# EAGLE design CxT6 (EAGLE 4.13)
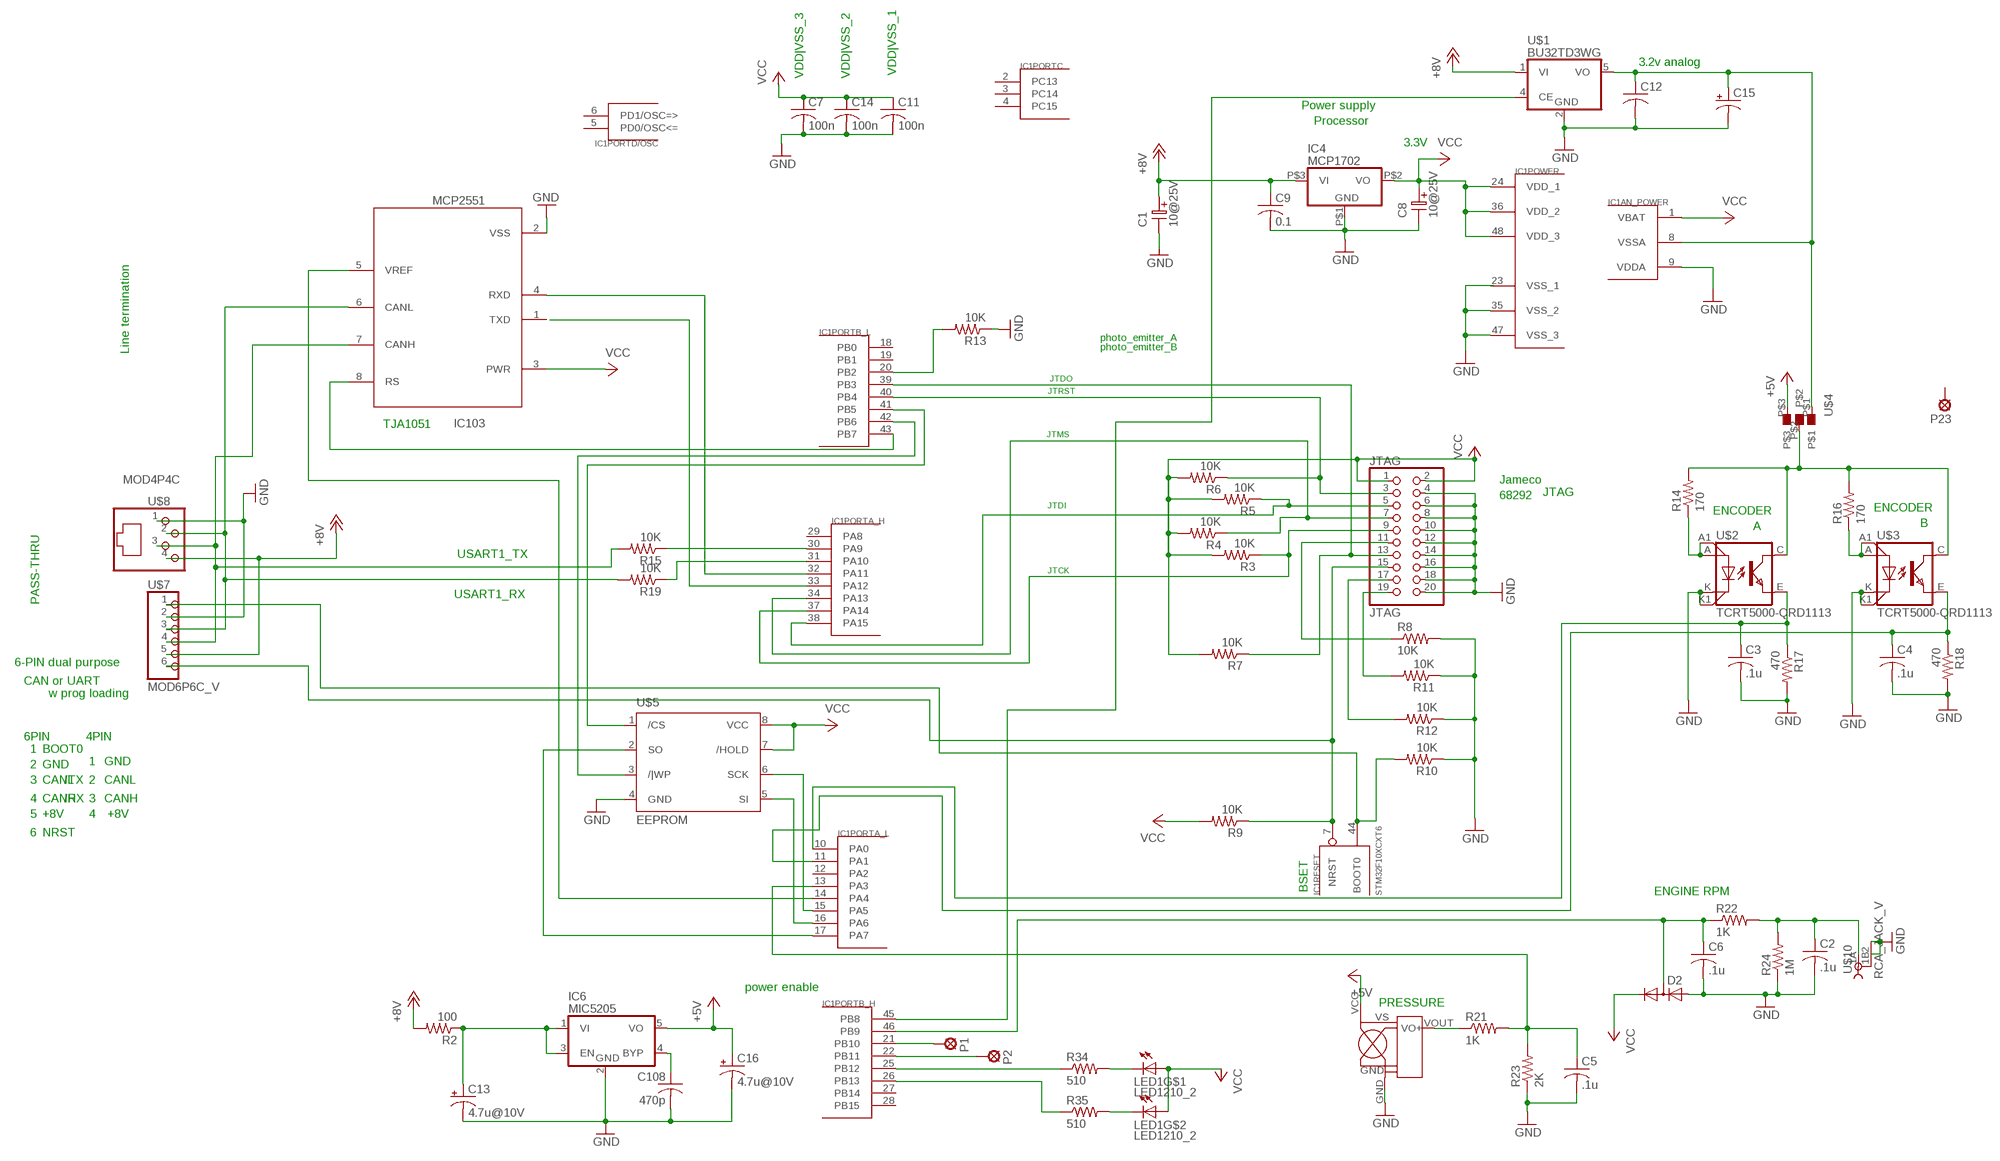
[diagram p0: schematic, sheet 1]

## Parts
C1  10@25V  ELC-2,5L  [ES-2,5L]
C2  .1u  C-USC0805  [C0805]
C3  .1u  C-USC0805  [C0805]
C4  .1u  C-USC0805  [C0805]
C5  .1u  C-USC0805  [C0805]
C6  .1u  C-USC0805  [C0805]
C7  100n  C-USC0603  [C0603]
C8  10@25V  ELC-2,5L  [ES-2,5L]
C9  0.1  C-USC0603  [C0603]
C11  100n  C-USC0603  [C0603]
C12  C-USC0603  [C0603]
C13  4.7u@10V  CPOL-USCT3528  [CT3528]
C14  100n  C-USC0603  [C0603]
C15  CPOL-USE5-8.5  [E5-8,5]
C16  4.7u@10V  CPOL-USCT3528  [CT3528]
C108  470p  C-USC0603  [C0603]
D2  DIODE_2CACA-SOT23  [SOT23]
IC1  STM32F10XCXT6  [TQFP48]
IC4  MCP1702  [SOT-23A]
IC6  MIC5205  [SOT-25]
IC103  MCP2551  [SO-08]
JTAG  JTAG  PINHD-2X10_KEYED  [2X10_KEYED]
LED1  LED1210_2  [CHIP2LED_1210]
P1  PE14  SOLDPAD028  [SOLPAD028]
P2  PE14  SOLDPAD028  [SOLPAD028]
P23  PE14  SOLDPAD028  [SOLPAD028]
R2  100  R-US_R0603  [R0603]
R3  10K  R-US_R0603  [R0603]
R4  10K  R-US_R0603  [R0603]
R5  10K  R-US_R0603  [R0603]
R6  10K  R-US_R0603  [R0603]
R7  10K  R-US_R0603  [R0603]
R8  10K  R-US_R0603  [R0603]
R9  10K  R-US_R0603  [R0603]
R10  10K  R-US_R0603  [R0603]
R11  10K  R-US_R0603  [R0603]
R12  10K  R-US_R0603  [R0603]
R13  10K  R-US_R0603  [R0603]
R14  170  R-US_M0805  [M0805]
R15  10K  R-US_R0603  [R0603]
R16  170  R-US_M0805  [M0805]
R17  470  R-US_R0603  [R0603]
R18  470  R-US_R0603  [R0603]
R19  10K  R-US_R0603  [R0603]
R21  1K  R-US_R0603  [R0603]
R22  1K  R-US_R0603  [R0603]
R23  2K  R-US_R0603  [R0603]
R24  1M  R-US_R0603  [R0603]
R34  510  R-US_R0603  [R0603]
R35  510  R-US_R0603  [R0603]
U$1  BU32TD3WG  XC6701  [SOT-25]
U$2  TCRT5000-QRD1113  [TCRT-QRD1114]
U$3  TCRT5000-QRD1113  [TCRT-QRD1114]
U$4  SMD-3  [SMD_3]
U$5  EEPROM  [TSSOP8]
U$6  MPXV6115  [482A]
U$7  MOD6P6C_V  [MOD6P6C_VERT]
U$8  MOD4P4C  [MOD4P4C]
U$10  RCA_JACK_V  [RCA_JACK_V]

## Nets
+5V: C16.+ IC6.5(VO) U$4.P$3 U$6.VCC(VS)
+8V: C1.1 C9.1 IC4.P$3(VI) R2.2 U$1.1(VI) U$7.5 U$8.4
+8V_VIA_RESISTOR: C13.+ IC6.1(VI) IC6.3(EN) R2.1
BOOT0: IC1.44(RESET:BOOT0) R10.2 U$7.1
BOOT1: IC1.20(PORTB_L:PB2) R13.2
CANH: IC103.7(CANH) R15.2 U$7.4 U$8.3
CANL: IC103.6(CANL) R19.2 U$7.3 U$8.2
CANRXD: IC1.32(PORTA_H:PA11) IC103.4(RXD)
CANTXD: IC1.33(PORTA_H:PA12)
EEPROM_/CS: IC1.41(PORTB_L:PB5) U$5.1(/CS)
EEPROM_/WP: IC1.42(PORTB_L:PB6) U$5.3(/|WP)
EEPROM_SCK: IC1.15(PORTA_L:PA5) U$5.6(SCK)
EEPROM_SI: IC1.16(PORTA_L:PA6) U$5.5(SI)
EEPROM_SO: IC1.17(PORTA_L:PA7) U$5.2(SO)
ENCODER_A_ANODE: R14.1 U$2.A1(ANODE1) U$2.A(ANODE)
ENCODER_B_ANODE: R16.1 U$3.A1(ANODE1) U$3.A(ANODE)
GND: C1.2 C2.2 C3.2 C4.2 C5.2 C6.2 C7.2 C8.2 C9.2 C11.2 C12.2 C13.- C14.2 C15.- C16.- C108.2 D2.1(A) IC1.9(AN_POWER:VDDA) IC1.35(POWER:VSS_2) IC1.47(POWER:VSS_3) IC4.P$1(GND) IC6.2(GND) IC103.2(VSS) JTAG.4 JTAG.6 JTAG.8 JTAG.10 JTAG.12 JTAG.14 JTAG.16 JTAG.18 JTAG.20 R8.2 R10.1 R11.1 R12.1 R13.1 R17.2 R18.2 R23.1 R24.1 U$1.2(GND) U$2.K1(CATHODE1) U$2.K(CATHODE) U$3.K1(CATHODE1) U$3.K(CATHODE) U$5.4(GND) U$6.GND U$7.2 U$8.1 U$10.1B U$10.2
IC6_BYP: C108.1 IC6.4(BYP)
JTAG_R-TO-GND-11: JTAG.11 R8.1
JTAG_R-TO-GND-17: JTAG.17 R12.2
JTAG_R-TO-GND-19: JTAG.19 R11.2
JTCK: IC1.37(PORTA_H:PA14) JTAG.9 R3.1
JTDI: IC1.38(PORTA_H:PA15) JTAG.5 R5.1
JTDO: IC1.39(PORTB_L:PB3) JTAG.13 R7.1
JTIMS: IC1.34(PORTA_H:PA13) JTAG.7 R4.1
JTRST: IC1.40(PORTB_L:PB4) JTAG.3 R6.1
NRST: IC1.7(RESET:NRST) JTAG.15 R9.1 U$7.6
PA3_ADC123IN1_PRESSURE: C5.1 IC1.13(PORTA_L:PA3) R21.2 R23.2
PA9_USART1_TX: IC1.30(PORTA_H:PA9) R15.1
PA10_USART1_RX: IC1.31(PORTA_H:PA10) R19.1
PB4_CAN_VREF: IC1.14(PORTA_L:PA4) IC103.5(VREF)
PB7_CAN_RS: IC1.43(PORTB_L:PB7) IC103.8(RS)
PB8_3.2V_ENABLE: IC1.45(PORTB_H:PB8) U$1.4(CE)
PB11_ENG_PULSE: C6.1 D2.3(AC) IC1.46(PORTB_H:PB9) R22.1
PB12_LED: IC1.25(PORTB_H:PB12) R34.1
PB12_LED1: LED1.C R34.2
PB13_LED: IC1.26(PORTB_H:PB13) R35.1
PB13_LED2: LED1.C1(C) R35.2
PHOTO_EMITTER_A: C3.1 IC1.10(PORTA_L:PA0) R17.1 U$2.E(EMITTER)
PHOTO_EMITTER_B: C4.1 IC1.11(PORTA_L:PA1) R18.1 U$3.E(EMITTER)
PHOTOSENSOR_V+: R14.2 R16.2 U$2.C(COLLECTOR) U$3.C(COLLECTOR) U$4.P$2
PRESSURE_OUT: R21.1 U$6.VOUT
SPRK_PICKUP: C2.1 R22.2 R24.2 U$10.1A
USART3_RX|XBEE: IC1.22(PORTB_H:PB11) P2.MP
USART3_TX|XBEE: IC1.21(PORTB_H:PB10) P1.MP
V3.2_ANALOG: C12.1 C15.+ IC1.8(AN_POWER:VSSA) U$1.5(VO) U$4.P$1
VCC: C7.1 C8.1 C11.1 C14.1 D2.2(C) IC1.1(AN_POWER:VBAT) IC1.24(POWER:VDD_1) IC1.36(POWER:VDD_2) IC1.48(POWER:VDD_3) IC4.P$2(VO) IC103.3(PWR) JTAG.1 JTAG.2 LED1.A LED1.A1(A) R3.2 R4.2 R5.2 R6.2 R7.2 R9.2 U$5.7(/HOLD) U$5.8(VCC)
Unconnected: IC1.2(PORTC:PC13) IC1.3(PORTC:PC14) IC1.4(PORTC:PC15) IC1.5(PORTD/OSC:PD0/OSC<=) IC1.6(PORTD/OSC:PD1/OSC=>) IC1.12(PORTA_L:PA2) IC1.18(PORTB_L:PB0) IC1.19(PORTB_L:PB1) IC1.27(PORTB_H:PB14) IC1.28(PORTB_H:PB15) IC1.29(PORTA_H:PA8) IC103.1(TXD) P23.MP

## Notes on the sheet
- 3.2v analog
- VDD|VSS_3 | VDD|VSS_2 | VDD|VSS_1
- Power supply
- Processor
- 3.3V
- photo_emitter_A
- photo_emitter_B
- Line termination
- JTDO
- JTRST
- TJA1051
- JTMS
- Jameco
- 68292 | JTAG
- JTDI
- ENCODER | ENCODER
- A | B
- USART1_TX
- JTCK
- USART1_RX
- PASS-THRU
- 6-PIN dual purpose
- CAN or UART
- w prog loading
- 6PIN | 4PIN
- 1 | BOOT0
- 2 | GND | 1 | GND
- 3 | CANL | /TX | 2 | CANL
- 4 | CANH | /RX | 3 | CANH
- 5 | +8V | 4 | +8V
- 6 | NRST
- BSET | ENGINE RPM
- power enable
- PRESSURE

## Power pins joined to a net without a drawn wire
VSS_1: IC1.23(POWER:VSS_1)

## Library data of the parts
C1 C8 = DEH:ELC-2,5L
C2-C7 C9 C11 C12 C14 C108 = rcl:C-US: CAPACITOR, American symbol
C13 C15 C16 = rcl:CPOL-US: POLARIZED CAPACITOR, American symbol
D2 = diode-1:DIODE_2CACA-: 2 Diodes - Cathode-Anode|Cathode-Anode
IC1 = stm32:STM32F10XCXT6: ST STM32F101/103 48pin LQFP
IC4 = linear:MCP1702
IC6 = linear:MIC5205
IC103 = texas:MCP2551
JTAG = pinhead:PINHD-2X10_KEYED
LED1 = led:LED1210_2
P1 P2 P23 = solpad:SOLDPAD028
R2-R19 R21-R24 R34 R35 = rcl:R-US_: RESISTOR, American symbol
U$1 = linear:XC6701
U$2 U$3 = tcrt5000:TCRT5000-QRD1113
U$4 = solpad:SMD-3
U$5 = texas:EEPROM
U$6 = motorola-sensor-driver:MPXV6115
U$7 = DEH:MOD6P6C_V
U$8 = DEH:MOD4P4C
U$10 = DEH:RCA_JACK_V

## Board
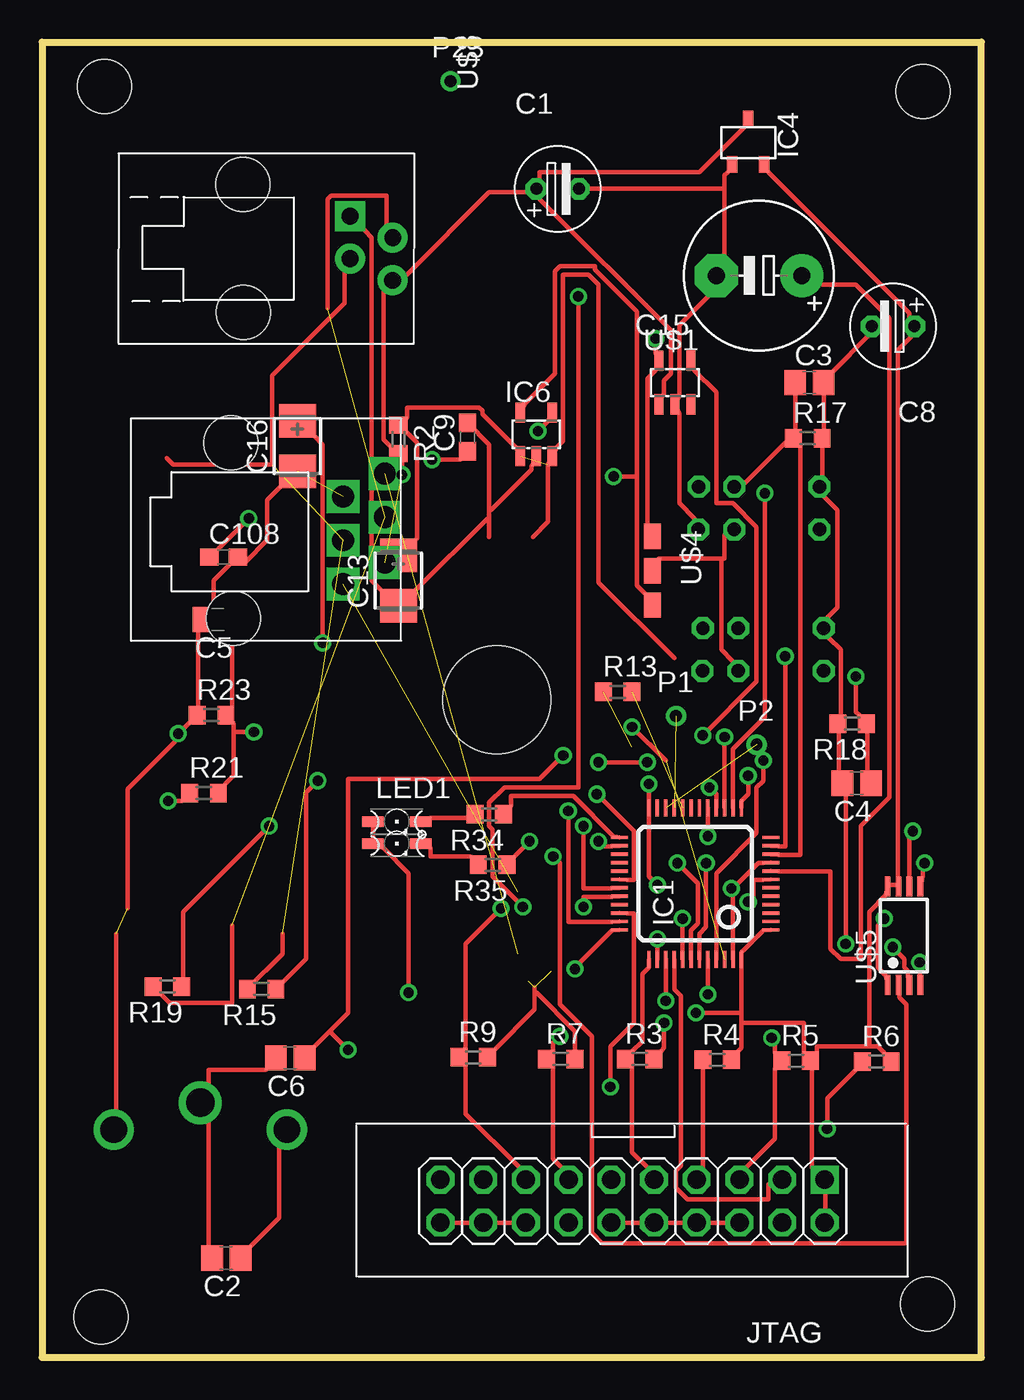
[diagram p1: board, top side]
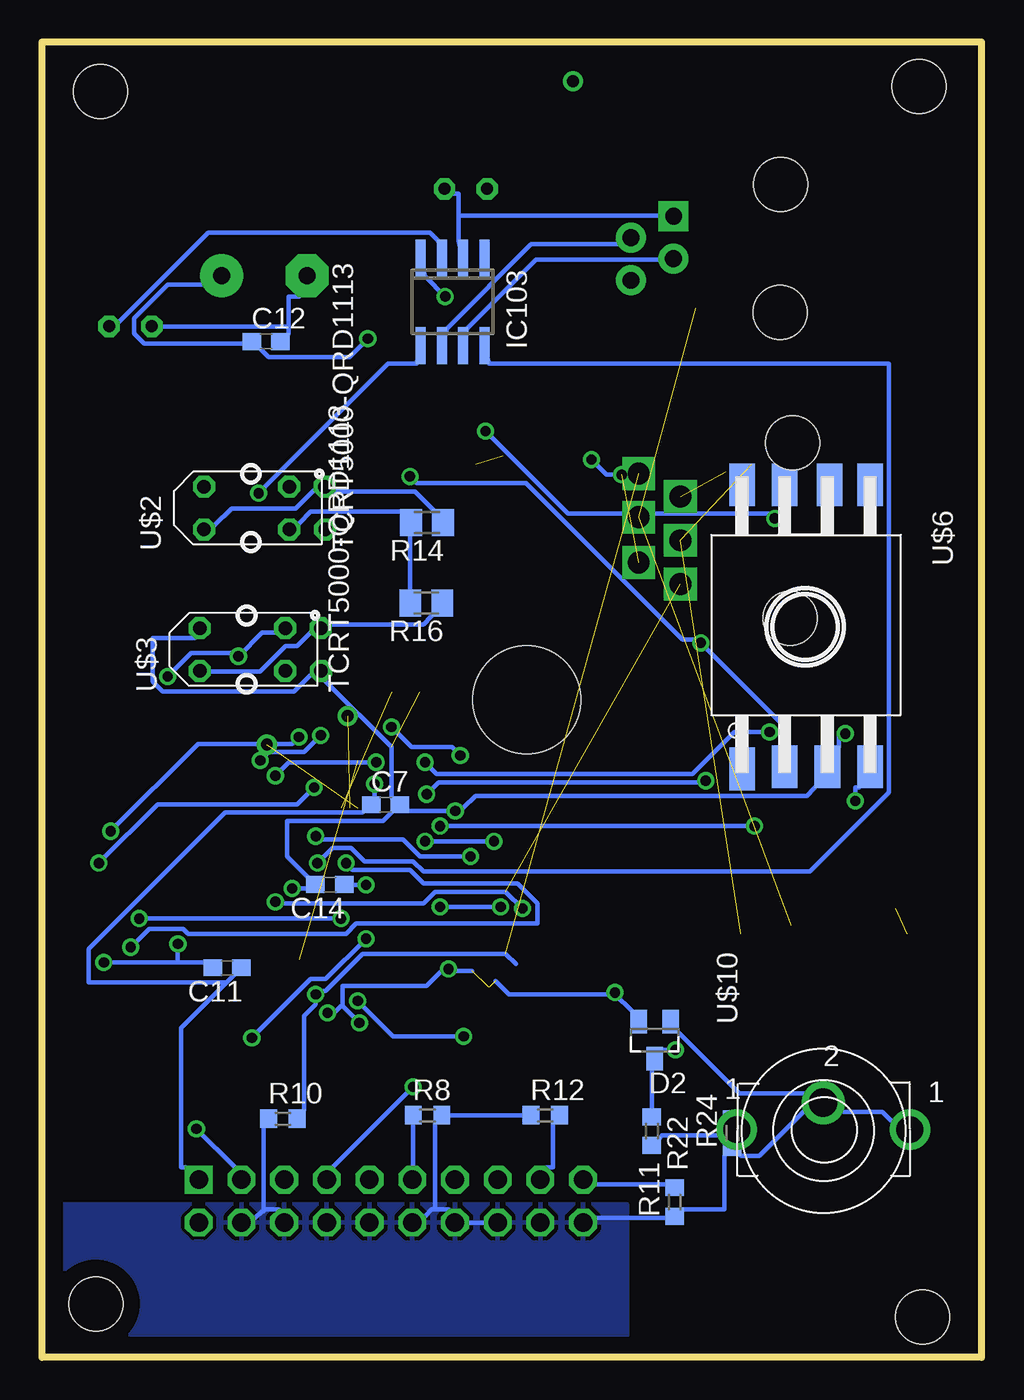
[diagram p2: board, bottom side, seen from below]

Size 55.88 x 78.23 mm. Coordinates in mm from the lower left corner, seen from the top.
Outline: 0,78.23 0,0 55.88,0 55.88,78.23 0,78.23
Copper layers (1*16): Top 0.035mm / dielectric 1.5mm / Bottom 0.035mm
Design rules "default": minimum track width 10mil, minimum drill 24mil, track to track 8mil, track to pad 8mil, pad to pad 8mil, via to via 8mil, smd to smd 8mil, copper to edge 40mil, drill to drill 8mil, minimum pad ring 10mil, minimum via ring 8mil, stop-mask expansion 4mil, vias tented up to drill 0mil, thermal gap 10mil
Holes 3.2 mm at 3.5,2.4 3.7,75.6 52.4,75.28 52.68,3.18
Holes 6.4 mm at 27.05,39.12

### Footprints (pad centres in the part's own frame; a part is rotated, then mirrored left to right if it is on the bottom)
ES-2,5L = drill 0.711 pad 1.27 octagon: 1 0,0; 2 2.54,0
C0805 = smd 1.3 x 1.5: 1 -0.85,0; 2 0.85,0
C0603 = smd 1.1 x 1: 1 -0.85,0; 2 0.85,0
CT3528 = smd 2 x 2.2: + 1.5,0; - -1.5,0
E5-8,5 = drill 1 pad 2.54 round: + -2.54,0 | drill 1 pad 2.54 octagon: - 2.54,0
SOT23 = smd 1 x 1.4: 1 -0.95,-1.1; 2 0.95,-1.1; 3 0,1.1
TQFP48 = smd 0.2 x 1: 1 -2.75,-4.5; 2 -2.25,-4.5; 3 -1.75,-4.5; 4 -1.25,-4.5; 5 -0.75,-4.5; 6 -0.25,-4.5; 7 0.25,-4.5; 8 0.75,-4.5; 9 1.25,-4.5; 10 1.75,-4.5; 11 2.25,-4.5; 12 2.75,-4.5; 25 2.75,4.5; 26 2.25,4.5; 27 1.75,4.5; 28 1.25,4.5; 29 0.75,4.5; 30 0.25,4.5; 31 -0.25,4.5; 32 -0.75,4.5; 33 -1.25,4.5; 34 -1.75,4.5; 35 -2.25,4.5; 36 -2.75,4.5 | smd 1 x 0.2: 13 4.5,-2.75; 14 4.5,-2.25; 15 4.5,-1.75; 16 4.5,-1.25; 17 4.5,-0.75; 18 4.5,-0.25; 19 4.5,0.25; 20 4.5,0.75; 21 4.5,1.25; 22 4.5,1.75; 23 4.5,2.25; 24 4.5,2.75; 37 -4.5,2.75; 38 -4.5,2.25; 39 -4.5,1.75; 40 -4.5,1.25; 41 -4.5,0.75; 42 -4.5,0.25; 43 -4.5,-0.25; 44 -4.5,-0.75; 45 -4.5,-1.25; 46 -4.5,-1.75; 47 -4.5,-2.25; 48 -4.5,-2.75
SOT-23A = smd 0.6 x 1: P$1 -0.95,-1.35; P$2 0.95,-1.35; P$3 0,1.35
SOT-25 = smd 0.55 x 1.2: 1 -0.95,-1.3; 2 0,-1.3; 3 0.95,-1.3; 4 0.95,1.3; 5 -0.95,1.3
SO-08 = smd 0.6 x 2.2: 1 -1.905,-2.6; 2 -0.635,-2.6; 3 0.635,-2.6; 4 1.905,-2.6; 5 1.905,2.6; 6 0.635,2.6; 7 -0.635,2.6; 8 -1.905,2.6
2X10_KEYED = drill 1.1 square: 1 -11.46,-1.27 | drill 1.1 octagon: 2 -11.46,1.27; 3 -8.92,-1.27; 4 -8.92,1.27; 5 -6.38,-1.27; 6 -6.38,1.27; 7 -3.84,-1.27; 8 -3.84,1.27; 9 -1.3,-1.27; 10 -1.3,1.27; 11 1.24,-1.27; 12 1.24,1.27; 13 3.78,-1.27; 14 3.78,1.27; 15 6.32,-1.27; 16 6.32,1.27; 17 8.86,-1.27; 18 8.86,1.27; 19 11.4,-1.27; 20 11.4,1.27
CHIP2LED_1210 = smd 1.27 x 0.635: A -1.422,0.67; A1 -1.422,-0.64; C 1.422,0.67; C1 1.422,-0.64
SOLPAD028 = drill 0.7 pad 1.016 round: MP 0,0
R0603 = smd 1 x 1.1: 1 -0.85,0; 2 0.85,0
M0805 = smd 1.3 x 1.6: 1 -0.95,0; 2 0.95,0
TCRT-QRD1114 = drill 0.8 octagon: A -2.54,-1.27; A1 4.648,1.27; C 2.54,-1.27; E 2.54,1.27; K -2.54,1.27; K1 4.674,-1.27
SMD_3 = smd 1.5 x 1: P$1 -2.04,-0.27; P$2 0,-0.27; P$3 2.04,-0.27
TSSOP8 = smd 1.2 x 0.35: 1 -2.925,0.975; 2 -2.925,0.325; 3 -2.925,-0.325; 4 -2.925,-0.975; 5 2.925,-0.975; 6 2.925,-0.325; 7 2.925,0.325; 8 2.925,0.975
482A = smd 2.54 x 1.524: GND 8.382,1.27; NC1 8.509,-3.81; NC2 -8.382,3.81; NC3 -8.382,1.397; NC4 -8.382,-1.27; NC5 -8.382,-3.81; VCC 8.382,-1.27; VOUT 8.382,3.81
MOD6P6C_VERT = drill 1.3 pad 1.778 square: 1 -2.694,0; 2 -1.324,-2.486; 3 -0.1,0; 4 1.27,-2.486; 5 2.594,0; 6 3.864,-2.486 | hole 3.2: -4.537,-9.154; 5.907,-9
MOD4P4C = drill 1 pad 1.778 square: 1 1.896,6.334 | drill 1 pad 1.778 round: 2 3.176,8.88; 3 4.43,6.344; 4 5.71,8.87 | hole 3.2: 7.627,0; 0.02,-0.02
RCA_JACK_V = drill 1.6 round: 1A -5.15,0; 1B 5.15,0 | drill 1.7 round: 2 0,1.6

### Placement (x,y rotation side)
C1  29.4,69.5 0 top
C2  10.96,5.91 180 top
C3  45.64,57.97 0 top
C4  48.46,34.15 180 top
C5  10.46,43.88 180 top
C6  14.76,17.81 180 top
C7  35.44,32.87 0 bottom
C8  51.89,61.33 180 top
C9  25.31,54.74 90 top
C11  44.86,23.18 180 bottom
C12  42.54,60.42 0 bottom
C13  21.2,46.2 90 top
C14  38.76,28.13 180 bottom
C15  42.65,64.34 180 top
C16  15.2,54.2 90 top
C108  10.8,47.6 0 top
D2  19.44,18.87 180 bottom
IC1  38.85,28.18 90 top
IC4  42,72.3 0 top
IC6  29.4,54.9 0 top
IC103  31.46,62.78 180 bottom
JTAG  35.1,9.3 180 top
LED1  21.1,31.2 0 top
P1  37.71,38.15 0 top
P2  42.51,36.45 0 top
P23  24.3,75.9 0 top
R2  21.2,54.6 270 top
R3  35.55,17.75 0 top
R4  40.15,17.7 0 top
R5  44.85,17.65 0 top
R6  49.65,17.6 0 top
R7  30.85,17.75 0 top
R8  32.95,14.4 0 bottom
R9  25.65,17.85 0 top
R10  41.55,14.2 0 bottom
R11  18.25,9.25 90 bottom
R12  25.95,14.4 0 bottom
R13  34.24,39.59 0 top
R14  32.98,49.66 180 bottom
R15  13.06,21.91 180 top
R16  33.02,44.87 180 bottom
R17  45.55,54.67 0 top
R18  48.18,37.7 180 top
R19  7.46,22.06 180 top
R21  9.64,33.57 0 top
R22  19.61,13.46 270 bottom
R23  10.09,38.21 0 top
R24  14.83,13.34 90 bottom
R34  26.6,32.3 180 top
R35  26.8,29.3 180 top
U$1  37.65,57.98 0 top
U$2  43.71,50.52 0 bottom
U$3  43.96,42.1 0 bottom
U$4  36.57,46.79 270 top
U$5  51.27,25.09 90 top
U$6  10.44,43.51 270 bottom
U$7  20.39,49.87 270 top
U$8  11.98,69.77 270 top
U$10  9.41,13.55 0 bottom

### Tracks (layer width: path | path; a pad name or v marks a point on that pad's centre or on a via)
+5V  (via drill 0.61)
  Top 0.254: 35.4,52.4 35.4,45.9 35.9,45.4 U$4.P$3 | 35.4,52.4 35.4,62.2 32.9,64.7 32.9,64.9 30.8,64.9 30.5,64.6 30.5,58.5 28.7,56.7 IC6.5 | v16.7,42.5 16.7,54.3 16.2,54.8 C16.+ | v34,52.4 35.4,52.4
  Bottom 0.254: U$6.VCC 11.7,36.3 11.7,37.5 v16.7,42.5 17.2,42.7 17.8,42.7 27.1,52 33.6,52 v34,52.4
+8V  (via drill 0.61)  (1 unrouted)
  Top 0.254: v23.2,53.4 24.9,53.4 C9.1 | v21.4,52.5 21.4,53.3 R2.2 20.7,54.2 20.3,54.6 20.3,63.4 U$8.4 21.7,64.4 26.6,69.3 28.8,69.3 C1.1 | IC4.P$3 41.8,73.2 39.1,70.5 29.6,70.5 29.6,70.1 C1.1 | U$1.1 36.9,57.2 37,57.3 37,58.1 37.4,58.5 37.4,61.1 29.6,68.9 C1.1
  Bottom 0.254: v23.2,53.4 22.3,52.5 v21.4,52.5
+8V_VIA_RESISTOR  (1 unrouted)
  Top 0.254: 37.6,41.6 33.1,46.1 33.1,63.8 32.5,64.4 31,64.4 31,54.5 30.6,54.1 IC6.3 30.1,53.1 30.1,49.7 29.2,48.8 | C13.+ 22.2,48.6 22.3,48.7 22.3,54.4 21.7,55 R2.1 21.7,55.9 21.7,56.5 26,56.5 26.2,56.3 26.2,56.1 28.2,54.1 IC6.1
BOOT0  (via drill 0.61)  (1 unrouted)
  Top 0.254: v39.6,21.6 IC1.44
  Bottom 0.254: R10.2 40.3,14.7 40.3,20.3 39.6,21 v39.6,21.6 39.1,21.8 39,21.8 36.8,24 28.3,24 27.7,23.4
BOOT1  (1 unrouted)
CANH  (2 unrouted)
  Top 0.254: 14.3,25.2 14.3,24 R15.2 | 7.4,53.5 7.8,53.1 13.7,53.1 13.7,58.4 18,62.7 18,64.5 U$8.3
  Bottom 0.254: IC103.7 30.6,61.2 26.5,65.3 19.2,65.3 U$8.3
CANL  (2 unrouted)
  Top 0.254: 11.3,25.7 11.3,21.1 7.6,21.1 7.1,21.6 R19.2 | 17,62.4 17,68.9 17.2,69.1 20.5,69.1 20.5,67.4 U$8.2
  Bottom 0.254: IC103.6 31.8,61.2 26.8,66.2 21.7,66.2 U$8.2
CANRXD  (via drill 0.61)
  Top 0.254: v32.2,26.8 32.2,27.4 33.9,27.4 IC1.32 | v28.6,26.8 26.8,28.6 26.8,31.4 26.6,31.6 26.6,33 27.5,33.9 31.9,33.9 v31.9,63.1
  Bottom 0.254: v28.6,26.8 v32.2,26.8 | v31.9,63.1 33.1,64.3 IC103.4
EEPROM_/CS  (via drill 0.61)
  Top 0.254: v50.1,26.1 49.7,25.7 49.7,23.2 50.2,22.7 U$5.1 | IC1.41 v38.1,26.1
  Bottom 0.254: v38.1,26.1 v50.1,26.1
EEPROM_/WP  (via drill 0.61)
  Top 0.254: v37.8,29.4 39,28.2 39,25.8 38.6,25.4 IC1.42 | v50.6,24.4 51.3,23.7 51.3,23.2 51.5,23 51.5,22.7 U$5.3
  Bottom 0.254: v37.8,29.4 37.4,29 34,29 33.2,28.2 27.6,28.2 26.4,27 26.4,25.8 37.2,25.8 37.8,25.2 47.2,25.2 47.5,25.5 49.5,25.5 v50.6,24.4
EEPROM_SCK  (via drill 0.61)
  Top 0.254: v51.8,31.3 51.6,31.1 51.6,28.6 U$5.6 | IC1.15 v40.6,36.9
  Bottom 0.254: v40.6,36.9 41,36.5 46.6,36.5 v51.8,31.3
EEPROM_SI  (via drill 0.61)
  Top 0.254: v39.7,33.9 40.1,33.5 IC1.16 | v52.5,29.4 52.4,29.3 52.4,28.6 U$5.5
  Bottom 0.254: v39.7,33.9 40.7,32.9 49,32.9 v52.5,29.4
EEPROM_SO  (via drill 0.61)
  Top 0.254: v30.4,29.8 30.8,29.4 30.8,21 32.7,19.1 32.7,7.4 33.3,6.8 51.4,6.8 51.4,21 51,21.4 51,21.6 U$5.2 | v39.6,31 IC1.17
  Bottom 0.254: v39.6,31 39.4,30.8 34.4,30.8 33.4,29.8 v30.4,29.8
ENCODER_A_ANODE
  Bottom 0.254: R14.1 32.6,50.4 33.7,51.5 38.5,51.5 U$2.A1 39.7,51.6 40.8,50.5 44.6,50.5 45.6,49.5 U$2.A
ENCODER_B_ANODE
  Bottom 0.254: R16.1 32.7,44.1 33.2,43.6 38.7,43.6 U$3.A1 39.9,43.1 40.7,42.3 41.4,42.3 42.9,40.8 45.9,40.8 U$3.A
GND  (via drill 0.61)  (3 unrouted)
  Top 0.254: 26.6,49.9 26.6,48.8 | 26.6,49.9 26.6,50.4 | 26.6,50.4 26.6,54.3 C9.2 | IC6.2 29.2,53.1 29.1,53 29.1,52.8 26.7,50.4 26.6,50.4 | 26.6,49.9 26.5,49.9 22.2,45.6 C13.- 20.2,45.6 19.6,46.2 19.6,66.6 19.2,67 U$8.1 | 41.1,27.9 42.6,29.4 42.9,29.4 IC1.9 | 41.1,27.9 IC1.47 | v31.3,32.5 31.3,25.9 33.9,25.9 IC1.35 | v41,27.9 41.1,27.9 | v52.2,23.5 52.2,22.7 U$5.4 | v47.8,24.6 47.8,33.5 C4.2 47.4,34.8 47.4,37.2 R18.2 47.5,38.2 47.5,42.1 46.8,42.8 U$3.K 46.7,44 47.3,44.6 47.3,50.4 46.5,51.2 U$2.K 46.4,52.4 46.4,54.2 R17.2 46.5,55.2 46.5,57.3 C3.2 47.1,58.7 49.1,60.7 C8.2 | U$2.K1 38.8,49.9 37.9,50.8 37.9,56.1 U$1.2 37.9,57.2 37.9,61.4 39.6,63.1 C15.- 40.6,65.6 40.6,69.5 | 40.6,69.5 40.6,70.3 40.8,70.5 IC4.P$1 | 40.6,69.5 C1.2 | JTAG.16 28,8 27,8 JTAG.18 25.5,8 24.5,8 JTAG.20 | JTAG.12 34.6,8 35.6,8 JTAG.10 37.2,8 38.2,8 JTAG.8 39.7,8 40.7,8 JTAG.6 | C16.- 14.2,51.8 13.4,51 13.4,48.6 12.1,47.3 C108.2 11.2,47.2 10.2,46.2 10.2,44.6 C5.2 9.3,43.2 9.3,38.7 R23.1 8.8,37.8 v8.1,37.1 7.9,36.6 5.1,33.8 5.1,26.7 | 4.4,25.2 4.4,14.7 U$10.1B | C2.2 9.9,6.6 9.9,13.9 U$10.2 9.9,16.4 9.9,17.1 13.3,17.1 C6.2
  Bottom 0.254: 31.1,67.9 31.1,69.2 31.4,69.2 C1.2 | 31.1,67.9 31.1,66.4 IC103.2 | U$8.1 19.2,67.9 31.1,67.9 | C7.2 34.1,32.5 v31.3,32.5 30.8,32.7 30.1,33.4 10.4,33.4 9.9,33.9 U$6.GND 8.5,36.3 8.5,37.1 v8.1,37.1 | C7.2 35.1,32.4 35.6,31.9 41.3,31.9 41.3,29.8 40.1,28.6 C14.2 40.1,27.9 v41,27.9 | C7.2 35.1,33.3 35.1,36.3 39,40.2 U$3.K1 39.9,40.6 40.9,39.6 48.7,39.6 49.3,40.2 49.3,42.8 46.8,42.8 U$3.K | 47.8,23.5 v52.2,23.5 | 47.8,23.5 46.2,23.5 C11.2 | v47.8,24.6 47.8,23.5 | 41.2,61.3 41.2,63.1 40.6,63.1 C15.- | 41.2,61.3 41.2,60.9 C12.2 | C8.2 48.8,61.3 41.2,61.3 | JTAG.20 22.9,8.3 18.7,8.3 R11.1 17.8,8.8 15.3,8.8 15.3,12 R24.1 14.3,12 13.2,12 10.6,14.6 U$10.2 | 42.7,8.8 42.7,13.7 R10.1 | 42.7,8.8 41.8,8.8 JTAG.6 | JTAG.4 43.2,8.3 42.8,8.7 42.7,8.7 42.7,8.8 | R12.1 R8.2 32.5,13.9 32.5,8.8 | 32.5,8.8 31.7,8.8 JTAG.14 30.5,8 29.6,8 JTAG.16 | JTAG.12 33.1,8.4 32.7,8.8 32.5,8.8 | D2.1 18,19.3 14.4,15.7 10.6,15.7 U$10.2 | U$10.1B 5.4,14.1 5.9,14.6 8.2,14.6 U$10.2
  pour Bottom: 21.1,1.1 21.1,9.1 54.9,9.1 54.9,0.7
IC6_BYP  (via drill 0.61)
  Top 0.254: v12.3,49.9 10.4,48 C108.1 | v29.5,55.1 30.1,55.7 IC6.4
  Bottom 0.254: v12.3,49.9 12.6,50.2 24.6,50.2 v29.5,55.1
JTAG_R-TO-GND-11
  Bottom 0.254: R8.1 33.8,11.3 JTAG.11
JTAG_R-TO-GND-17
  Bottom 0.254: R12.2 25.5,13.9 25.5,11.3 25.9,11.3 JTAG.17
JTAG_R-TO-GND-19
  Bottom 0.254: R11.2 18.7,10.3 22.9,10.3 JTAG.19
JTCK
  Top 0.254: IC1.37 36.1,23.2 35.7,22.8 35.7,18.8 35.1,18.2 R3.1 35.1,17.3 35.1,12.2 36,11.3 JTAG.9
JTDI  (via drill 0.61)
  Top 0.254: v43.4,19 43.6,18.8 43.6,18.1 R5.1 43.6,17.2 43.6,13 41.9,11.3 JTAG.5 | v36.6,24.9 IC1.38
  Bottom 0.254: v36.6,24.9 39,22.5 39.9,22.5 v43.4,19
JTDO  (via drill 0.61)
  Top 0.254: v30.8,19.1 30.4,18.7 30.4,18.2 R7.1 30.4,17.3 30.4,11.8 30.9,11.3 JTAG.13 | v37.1,21.2 IC1.39
  Bottom 0.254: v37.1,21.2 35,19.1 v30.8,19.1
JTIMS  (via drill 0.61)
  Top 0.254: v33.8,16.1 33.8,18.5 35.2,19.9 35.2,26.4 34.8,26.4 IC1.34 | R4.1 39.3,11.3 JTAG.7
  Bottom 0.254: v33.8,16.1 38.6,11.3 JTAG.7
JTRST  (via drill 0.61)
  Top 0.254: IC1.40 37.6,21.9 38,21.5 38,11.4 37.7,11.1 37.7,10.1 38.4,9.4 43.2,9.4 43.2,10.3 JTAG.3 | v46.7,13.6 46.7,15.4 48.4,17.1 R6.1
  Bottom 0.254: v46.7,13.6 44.4,11.3 JTAG.3
NRST  (via drill 0.61)  (1 unrouted)
  Top 0.254: v42,27.1 42.3,27.4 42.3,28.4 42.9,28.4 IC1.7 | v27.3,26.7 25.2,24.6 25.2,18.3 R9.1 25.2,17.4 25.2,14.5 28.4,11.3 JTAG.15
  Bottom 0.254: v42,27.1 41.9,27 33.2,27 32.5,27.7 28.3,27.7 v27.3,26.7
PA3_ADC123IN1_PRESSURE  (via drill 0.61)
  Top 0.254: v42,34.6 42,33.5 41.6,33.1 IC1.13 | v33.1,35.4 v36,35.4 | 11.4,37.2 v12.6,37.2 | 11.4,37.2 11.4,37.7 R23.2 11.3,38.7 11.3,43.2 C5.1 | R21.2 10.9,34.1 11.4,34.6 11.4,37.2
  Bottom 0.254: v42,34.6 41.2,35.4 v36,35.4 | v33.1,35.4 32.4,34.7 17.2,34.7 14.7,37.2 v12.6,37.2
PA9_USART1_TX  (via drill 0.61)
  Top 0.254: v33,33.5 35.2,31.3 35.2,28.4 34.8,28.4 IC1.30 | v16.4,34.3 15.7,33.6 15.7,23.7 R15.1
  Bottom 0.254: v33,33.5 32.3,34.2 16.5,34.2 v16.4,34.3
PA10_USART1_RX  (via drill 0.61)
  Top 0.254: v32.2,31.6 32.2,27.9 33.9,27.9 IC1.31 | v13.5,31.6 8.4,26.5 8.4,22.6 R19.1
  Bottom 0.254: v13.5,31.6 v32.2,31.6
PB4_CAN_VREF  (via drill 0.61)
  Top 0.254: v43,51.4 43,38.1 41.1,36.2 IC1.14
  Bottom 0.254: v43,51.4 35.3,59.1 33.6,59.1 IC103.5
PB7_CAN_RS  (via drill 0.61)
  Top 0.254: v39.5,29.4 39.5,25.6 39.1,25.2 IC1.43
  Bottom 0.254: v39.5,29.4 38.6,30.3 37.5,30.3 36.7,29.5 33.8,29.5 33.2,28.9 10.2,28.9 5.5,33.6 5.5,59.1 29.3,59.1 IC103.8
PB8_3.2V_ENABLE  (via drill 0.61)
  Top 0.254: v42.9,35.5 42.9,34.3 42.5,33.9 42.5,31.2 40.1,28.8 IC1.45 | v39.3,37 42.5,40.2 42.5,49.4 41.1,50.8 40.1,50.8 40.1,57.4 38.8,58.7 U$1.4
  Bottom 0.254: v42.9,35.5 42.4,36 40.3,36 v39.3,37
PB11_ENG_PULSE  (via drill 0.61)  (1 unrouted)
  Top 0.254: v35.1,37.5 37.1,35.5 | v31,35.8 29.6,34.4 18.2,34.4 18.2,20.5 17.15,19.45 | 17.15,19.45 16.2,18.5 C6.1 | v18.2,18.3 17.2,19.3 17.2,19.4 17.15,19.45
  Bottom 0.254: R22.1 19.6,14.8 19.6,17.1 D2.3 19,18.3 v18.2,18.3 | v35.1,37.5 33.9,36.3 31.5,36.3 v31,35.8
PB12_LED
  Top 0.254: IC1.25 34,31 31.6,33.4 27.9,33.4 27.9,32.8 R34.1
PB12_LED1
  Top 0.254: R34.2 25.3,32.1 23.1,32.1 LED1.C
PB13_LED  (via drill 0.61)
  Top 0.254: v33.1,30.7 33.1,30.4 33.9,30.4 IC1.26 | v29,30.7 28.1,29.8 R35.1
  Bottom 0.254: v29,30.7 v33.1,30.7
PB13_LED2
  Top 0.254: R35.2 25.5,29.8 23.1,29.8 23.1,30.3 LED1.C1
PHOTO_EMITTER_A
  Top 0.254: IC1.10 43.8,29.9 45.1,29.9 45.1,54.2 R17.1 | C3.1 44.8,57.3 44.8,55.2 R17.1 | U$2.E 41.8,52 44.2,54.4 R17.1
PHOTO_EMITTER_B  (via drill 0.61)
  Top 0.254: C4.1 49.1,34.8 49.1,37.2 R18.1 48.6,38.2 48.4,38.4 v48.4,40.5 | v44.2,41.7 44.2,30.4 43.8,30.4 IC1.11
  Bottom 0.254: U$3.E 42,43.1 42.8,43.1 v44.2,41.7 44.7,41.9 47,41.9 v48.4,40.5
PHOTOSENSOR_V+
  Top 0.254: 40.4,47.5 40.6,47.5 40.6,48.9 U$2.C | 40.4,47.5 36.7,47.5 U$4.P$2 | U$3.C 41.1,41.4 40.4,42.1 40.4,47.5
  Bottom 0.254: R16.2 34,45.6 34,48.9 R14.2 34.5,50.3 39.9,50.3 40.6,49.6 U$2.C
PRESSURE_OUT  (via drill 0.61)
  Top 0.254: v7.5,33.1 8.3,33.1 R21.1
  Bottom 0.254: v7.5,33.1 7.5,33.9 7.3,33.9 U$6.VOUT
SPRK_PICKUP
  Top 0.254: C2.1 12.4,6.6 14.1,8.3 14.1,12.4 U$10.1A
  Bottom 0.254: R24.2 14.8,14.2 U$10.1A 15.7,13.2 19,13.2 19.1,13.1 R22.2
USART3_RX|XBEE  (1 unrouted)
USART3_TX|XBEE  (1 unrouted)
V3.2_ANALOG  (via drill 0.61)
  Top 0.254: U$4.P$1 36,49.5 36,58.2 36.5,58.7 U$1.5 36.5,59.8 v36.5,60.6 | IC1.8 43.8,28.9 46.9,28.9 46.9,24.3 47.5,23.7 48.7,23.7 48.7,31.6 50.4,33.3 50.4,61.8 48.4,63.8 46.4,63.8 C15.+
  Bottom 0.254: C15.+ 46.4,63.8 48.4,63.8 50.4,61.8 50.4,60.9 49.8,60.3 43.9,60.3 C12.1 42.9,60 42.4,59.5 37.6,59.5 v36.5,60.6
VCC  (via drill 0.61)  (2 unrouted)
  Top 0.254: IC4.P$2 43.2,70.5 51.6,62.1 51.6,61.9 C8.1 51.7,60.7 50.9,59.9 50.9,28.6 U$5.7 50.8,28.1 50.4,28.1 U$5.8 50.2,27.5 49.2,26.5 49.2,18.5 | LED1.A 19.7,31.6 19.7,30.8 LED1.A1 20.3,30.3 21.8,28.8 v21.8,21.7 | v31.7,23.1 31.7,23.2 33.9,25.4 IC1.36 | 29.3,21.7 29.3,22 | 29.3,21.7 29.3,20.7 26.9,18.3 R9.2 | R7.2 31.7,19.4 29.4,21.7 29.3,21.7 | v37,19.9 37,18.4 36.8,18.2 R3.2 | IC1.1 42.9,25.4 41.6,24.1 IC1.48 41.6,20.5 | 41.6,20.5 41.6,19.9 | 41.6,19.9 41.6,18.4 41.4,18.2 R4.2 | v36.1,34.1 IC1.24 36.1,28.6 v36.6,28.1 | R5.2 45.8,17.2 45.8,11.3 JTAG.1 46.6,9.8 46.6,8.8 JTAG.2 | 49.2,18.5 46.1,18.5 46.1,18.1 R5.2 | 49.2,18.5 49.7,18.5 50.1,18.1 R6.2 | 41.6,19.9 45.3,19.9 45.3,18.1 R5.2 | v38.9,20.5 41.6,20.5
  Bottom 0.254: IC103.3 32.3,66.4 32.8,66.9 46,66.9 51.3,61.6 C8.1 | 30.3,23 31.6,23 v31.7,23.1 32.2,22.9 33,22.1 38,22.1 38,20.9 | v37,19.9 38,20.9 | 21.8,21.6 20.8,20.6 D2.2 | 21.8,21.6 28.1,21.6 28.9,22.4 | 21.8,21.6 v21.8,21.7 | v36.1,34.1 36.1,33.3 C7.1 36.8,32.4 45,32.4 53.1,24.3 53.1,22.3 45,22.3 44.95,22.25 | v36.6,28.1 37.4,28.1 C14.1 | 44.95,22.25 47.6,19.6 47.6,11.3 47.3,11.3 JTAG.1 | 44.95,22.25 44.5,22.7 C11.1 | v38.9,20.5 38.5,20.5 38.1,20.9 38,20.9